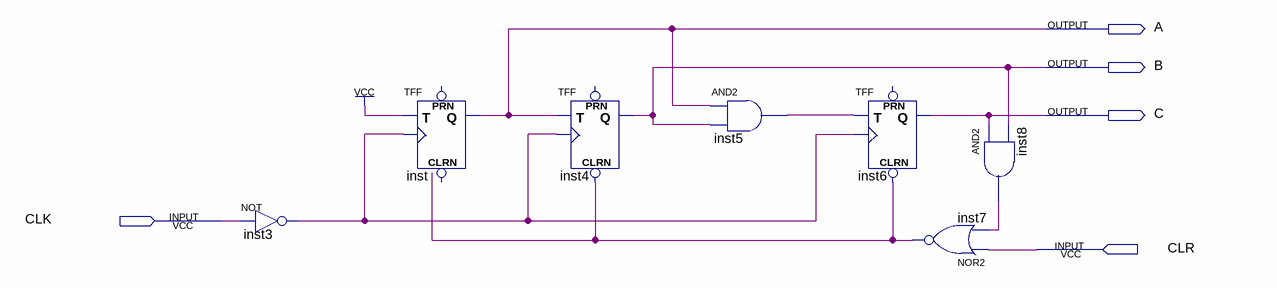
[diagram p0: schematic sheet]
// Quartus schematic CPLD_Recounter_Mod6.bdf as structural Verilog: 7 symbols, 5 pins
module CPLD_Recounter_Mod6 (
  input  CLK,
  input  CLR,
  output A,
  output B,
  output C
);

  wire inst3_out, inst5_out, inst7_out, inst8_out;

  not inst3 (inst3_out, CLK);
  TFF inst (.T(1'b1), .CLK(inst3_out), .Q(A));  // open: PRN, CLRN
  TFF inst4 (.CLRN(inst7_out), .T(A), .CLK(inst3_out), .Q(B));  // open: PRN
  and inst5 (inst5_out, A, B);
  TFF inst6 (.CLRN(inst7_out), .T(inst5_out), .CLK(inst3_out), .Q(C));  // open: PRN
  nor inst7 (inst7_out, CLR, inst8_out);
  and inst8 (inst8_out, C, B);
endmodule
